# Altium schematic sheet SingleBoardTestRev1.SchDoc
size A
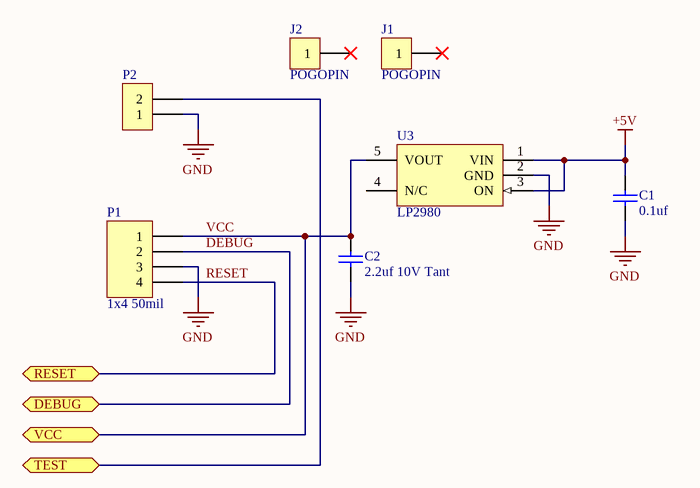
[diagram p0: SingleBoardTestRev1.SchDoc]

## Parts
C1  0.1uf  [0603_072205]
C2  2.2uf 10V Tant  [CAP A CASE_030205]
J1  POGOPIN  [TestPoint52x32]
J2  POGOPIN  [TestPoint52x32]
P1  1x4 50mil  [1X4 HEADER_50mil_071411]
P2  1x2 50mil  [1X2 HEADER_50MIL_081611]  (value not drawn)
U3  LP2980  [SOT25_030205]

## Ports
DEBUG, RESET, TEST, VCC

## Nets
+5V: C1.1 U3.1(VIN) U3.3(ON)
GND: C1.2 C2.2 P1.3 P2.1 U3.2(GND)
DEBUG: P1.2 ; port DEBUG
RESET: P1.4 ; port RESET
TEST: P2.2 ; port TEST
VCC: C2.1 P1.1 U3.5(VOUT) ; port VCC

Not connected (* = marked no-connect by the designer): J1 1*; J2 1*; U3 4(N/C)

## Library data of the parts
C1 = Cap: Capacitor; PARTNO: C0603C104Z3VACTU; MAN: Kemet; VALUE: 0.1uf; DK: 399-1100-2-ND
C2 = Cap: Capacitor; PARTNO: F931A225MAA; MAN: Nichicon; VALUE: 2.2uf 10V Tant; DK: 493-2356-1-ND
J1 J2 = CON1: Connector; VALUE: POGOPIN; DK: N/A; MAN: N/A; PARTNO: N/A
P1 = Header 4: Header, 4-Pin; VALUE: 1x4 50mil; DK: 4 PogoPins
P2 = CON2: DK: 2 PogoPins; VALUE: 1x2 50mil
U3 = LP2985: PARTNO: LP2980AIM5-3.3/NOPB; MAN: TI / National; VALUE: LP2980; DK: LP2980AIM5-3.3CT-ND